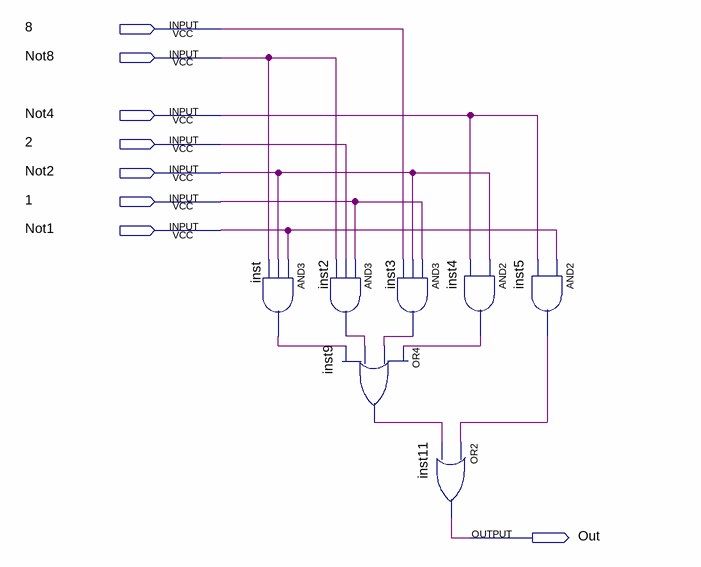
[diagram p0: schematic sheet]
// Quartus schematic B.bdf as structural Verilog: 7 symbols, 8 pins
module B (
  input  \8 ,
  input  Not8,
  input  Not4,
  input  \2 ,
  input  Not2,
  input  \1 ,
  input  Not1,
  output Out
);

  wire inst2_out, inst3_out, inst4_out, inst5_out, inst9_out, inst_out;

  and inst (inst_out, Not1, Not2, Not8);
  and inst2 (inst2_out, \1 , \2 , Not8);
  or inst9 (inst9_out, inst4_out, inst3_out, inst2_out, inst_out);
  and inst3 (inst3_out, \1 , Not2, \8 );
  or inst11 (Out, inst5_out, inst9_out);
  and inst4 (inst4_out, Not2, Not4);
  and inst5 (inst5_out, Not1, Not4);
endmodule
